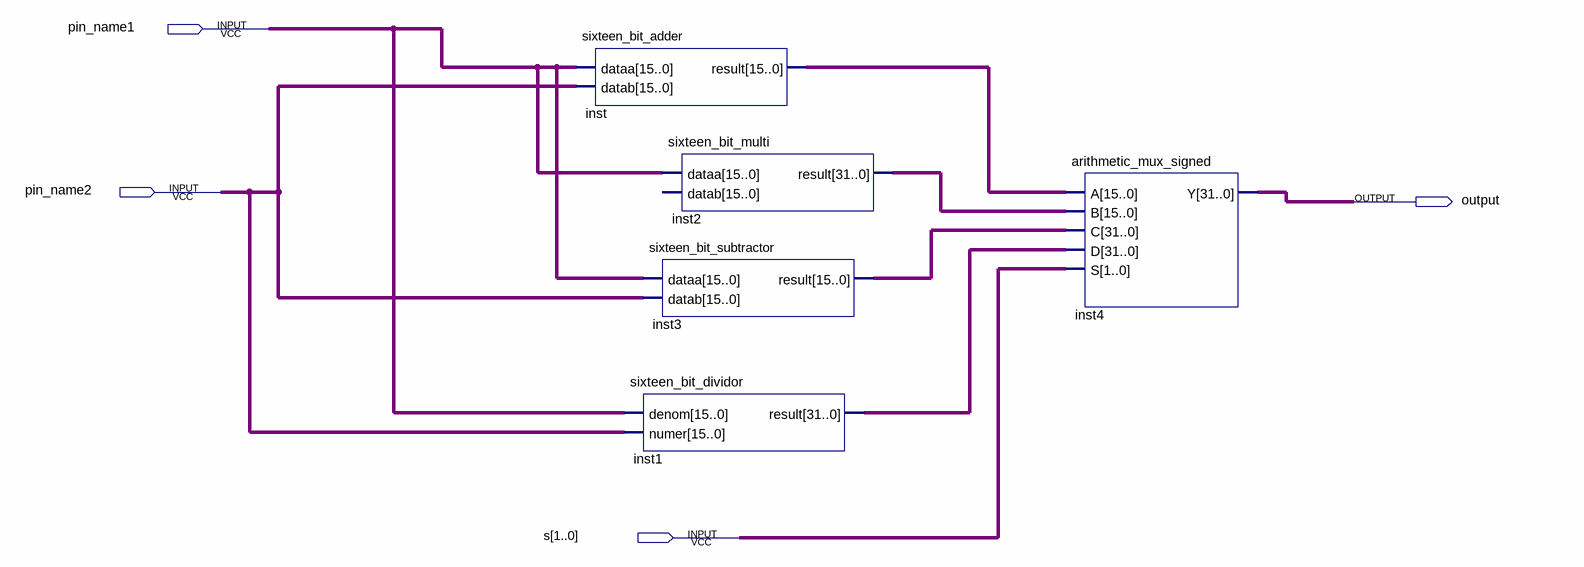
[diagram p0: schematic sheet]
// Quartus schematic arithmetic_alu.bdf as structural Verilog: 5 symbols, 4 pins
module arithmetic_alu (
  input  pin_name1,
  input  pin_name2,
  input  [1:0] s,
  output \output 
);

  wire [15:0] inst_result, undriven, undriven_2;
  wire [31:0] inst1_result, inst2_result, inst3_result, inst4_y;

  sixteen_bit_adder inst (.dataa(undriven_2), .datab(undriven), .result(inst_result));
  sixteen_bit_subtractor inst3 (.dataa(undriven_2), .datab(undriven), .result(inst3_result));
  sixteen_bit_dividor inst1 (.denom(undriven_2), .numer(undriven), .result(inst1_result));
  sixteen_bit_multi inst2 (.dataa(undriven_2), .result(inst2_result));  // open: datab
  arithmetic_mux_signed inst4 (
    .A(inst_result), .B(inst2_result), .C(inst3_result), .D(inst1_result), .S(s), .Y(inst4_y));
endmodule
